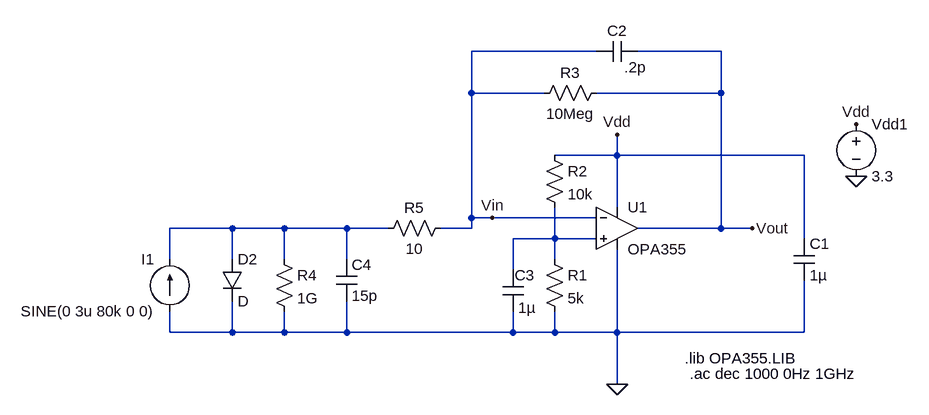
[diagram p0: schematic Draft6withPDequivalent.asc]
Draft6withPDequivalent.asc, the LTspice schematic file:
Version 4
SHEET 1 1028 680
WIRE 544 80 352 80
WIRE 736 80 608 80
WIRE 352 144 352 80
WIRE 464 144 352 144
WIRE 736 144 736 80
WIRE 736 144 544 144
WIRE 576 240 576 208
WIRE 576 240 480 240
WIRE 864 240 576 240
WIRE 576 320 576 240
WIRE 352 336 352 144
WIRE 384 336 352 336
WIRE 544 336 384 336
WIRE -16 352 -112 352
WIRE 64 352 -16 352
WIRE 160 352 64 352
WIRE 224 352 160 352
WIRE 352 352 352 336
WIRE 352 352 304 352
WIRE 736 352 736 144
WIRE 736 352 608 352
WIRE 784 352 736 352
WIRE 480 368 480 320
WIRE 480 368 416 368
WIRE 544 368 480 368
WIRE 864 368 864 240
WIRE -112 400 -112 352
WIRE -16 400 -16 352
WIRE 64 400 64 352
WIRE 160 400 160 352
WIRE 480 400 480 368
WIRE 416 416 416 368
WIRE -112 512 -112 480
WIRE -16 512 -16 464
WIRE -16 512 -112 512
WIRE 64 512 64 480
WIRE 64 512 -16 512
WIRE 160 512 160 464
WIRE 160 512 64 512
WIRE 416 512 416 480
WIRE 416 512 160 512
WIRE 480 512 480 480
WIRE 480 512 416 512
WIRE 576 512 576 384
WIRE 576 512 480 512
WIRE 864 512 864 432
WIRE 864 512 576 512
WIRE 576 592 576 512
FLAG 576 208 Vdd
FLAG 576 592 0
FLAG 944 272 0
FLAG 784 352 Vout
FLAG 384 336 Vin
FLAG 944 192 Vdd
SYMBOL OpAmps/opamp2 576 288 R0
SYMATTR InstName U1
SYMATTR Value OPA355
SYMATTR SpiceModel OPA355
SYMBOL cap 848 368 R0
SYMATTR InstName C1
SYMATTR Value 1µ
SYMBOL cap 608 64 R90
WINDOW 0 0 32 VBottom 2
WINDOW 3 25 4 VTop 2
SYMATTR InstName C2
SYMATTR Value .2p
SYMBOL cap 432 480 R180
WINDOW 0 -17 56 Left 2
WINDOW 3 -19 6 Left 2
SYMATTR InstName C3
SYMATTR Value 1µ
SYMBOL res 464 384 R0
SYMATTR InstName R1
SYMATTR Value 5k
SYMBOL res 464 224 R0
SYMATTR InstName R2
SYMATTR Value 10k
SYMBOL res 560 128 R90
WINDOW 0 0 56 VBottom 2
WINDOW 3 32 56 VTop 2
SYMATTR InstName R3
SYMATTR Value 10Meg
SYMBOL voltage 944 176 R0
SYMATTR InstName Vdd1
SYMATTR Value 3.3
SYMBOL res 48 384 R0
SYMATTR InstName R4
SYMATTR Value 1G
SYMBOL cap 144 400 R0
SYMATTR InstName C4
SYMATTR Value 15p
SYMBOL diode -32 400 R0
SYMATTR InstName D2
SYMBOL res 320 336 R90
WINDOW 0 0 56 VBottom 2
WINDOW 3 32 56 VTop 2
SYMATTR InstName R5
SYMATTR Value 10
SYMBOL current -112 480 R180
WINDOW 0 24 80 Left 2
WINDOW 3 24 0 Left 2
SYMATTR InstName I1
SYMATTR Value SINE(0 3u 80k 0 0)
SYMATTR Value2 AC 3u 0
TEXT 680 552 Left 2 !.lib OPA355.LIB
TEXT 688 576 Left 2 !.ac dec 1000 0Hz 1GHz

The netlist it stands for:
* Draft6withPDequivalent.asc
XU1 N002 Vin Vdd 0 Vout OPA355 OPA355  ; pins In+ In- V+ V- OUT
C1 Vdd 0 1µ
C2 Vout Vin .2p
C3 0 N002 1µ
R1 N002 0 5k
R2 Vdd N002 10k
R3 Vout Vin 10Meg
Vdd1 Vdd 0 3.3
R4 N001 0 1G
C4 N001 0 15p
D2 N001 0 D
R5 Vin N001 10
I1 0 N001 SINE(0 3u 80k 0 0) AC 3u 0
.model D D
.lib standard.dio
.lib OPA355.LIB
.ac dec 1000 0Hz 1GHz
.backanno
.end